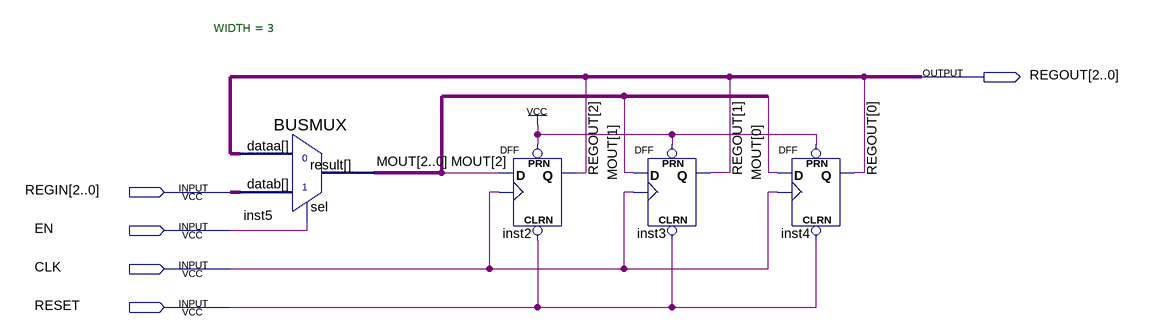
[diagram p0: schematic sheet]
// Quartus schematic Register3Bits.bdf as structural Verilog: 4 symbols, 5 pins
module Register3Bits (
  input  [2:0] REGIN,
  input  EN,
  input  CLK,
  input  RESET,
  output [2:0] REGOUT
);

  wire [2:0] MOUT;

  BUSMUX #(.WIDTH(3)) inst5 (.datab(REGIN), .sel(EN), .dataa(REGOUT), .result(MOUT));
  DFF inst2 (.CLRN(RESET), .CLK(CLK), .D(MOUT[2]), .PRN(1'b1), .Q(REGOUT[2]));
  DFF inst3 (.CLRN(RESET), .CLK(CLK), .D(MOUT[1]), .PRN(1'b1), .Q(REGOUT[1]));
  DFF inst4 (.CLRN(RESET), .CLK(CLK), .D(MOUT[0]), .PRN(1'b1), .Q(REGOUT[0]));
endmodule
